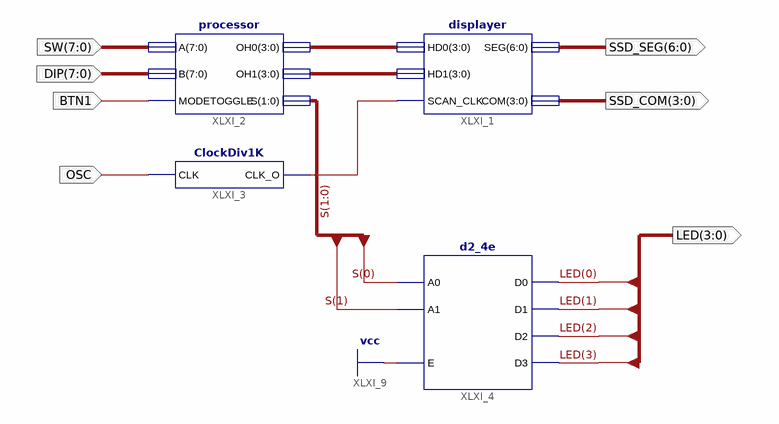
[diagram p0: schematic sheet 1]
// Xilinx ISE schematic main.sch (spartan6) as structural Verilog: 4 symbols, 7 ports
module main (
  input  [7:0] SW,
  input  [7:0] DIP,
  input  BTN1,
  input  OSC,
  output [6:0] SSD_SEG,
  output [3:0] SSD_COM,
  output [3:0] LED
);

  wire XLXN_3;
  wire [1:0] S;
  wire [3:0] XLXN_1, XLXN_4;

  displayer XLXI_1 (.HD0(XLXN_1), .HD1(XLXN_4), .SCAN_CLK(XLXN_3), .SEG(SSD_SEG), .COM(SSD_COM));
  processor XLXI_2 (.A(SW), .B(DIP), .MODETOGGLE(BTN1), .OH0(XLXN_1), .OH1(XLXN_4), .S(S));
  ClockDiv1K XLXI_3 (.CLK(OSC), .CLK_O(XLXN_3));
  d2_4e XLXI_4 (.A0(S[0]), .A1(S[1]), .E(1'b1), .D0(LED[0]), .D1(LED[1]), .D2(LED[2]), .D3(LED[3]));
endmodule
